# EAGLE design pcb (EAGLE 9.6.2)
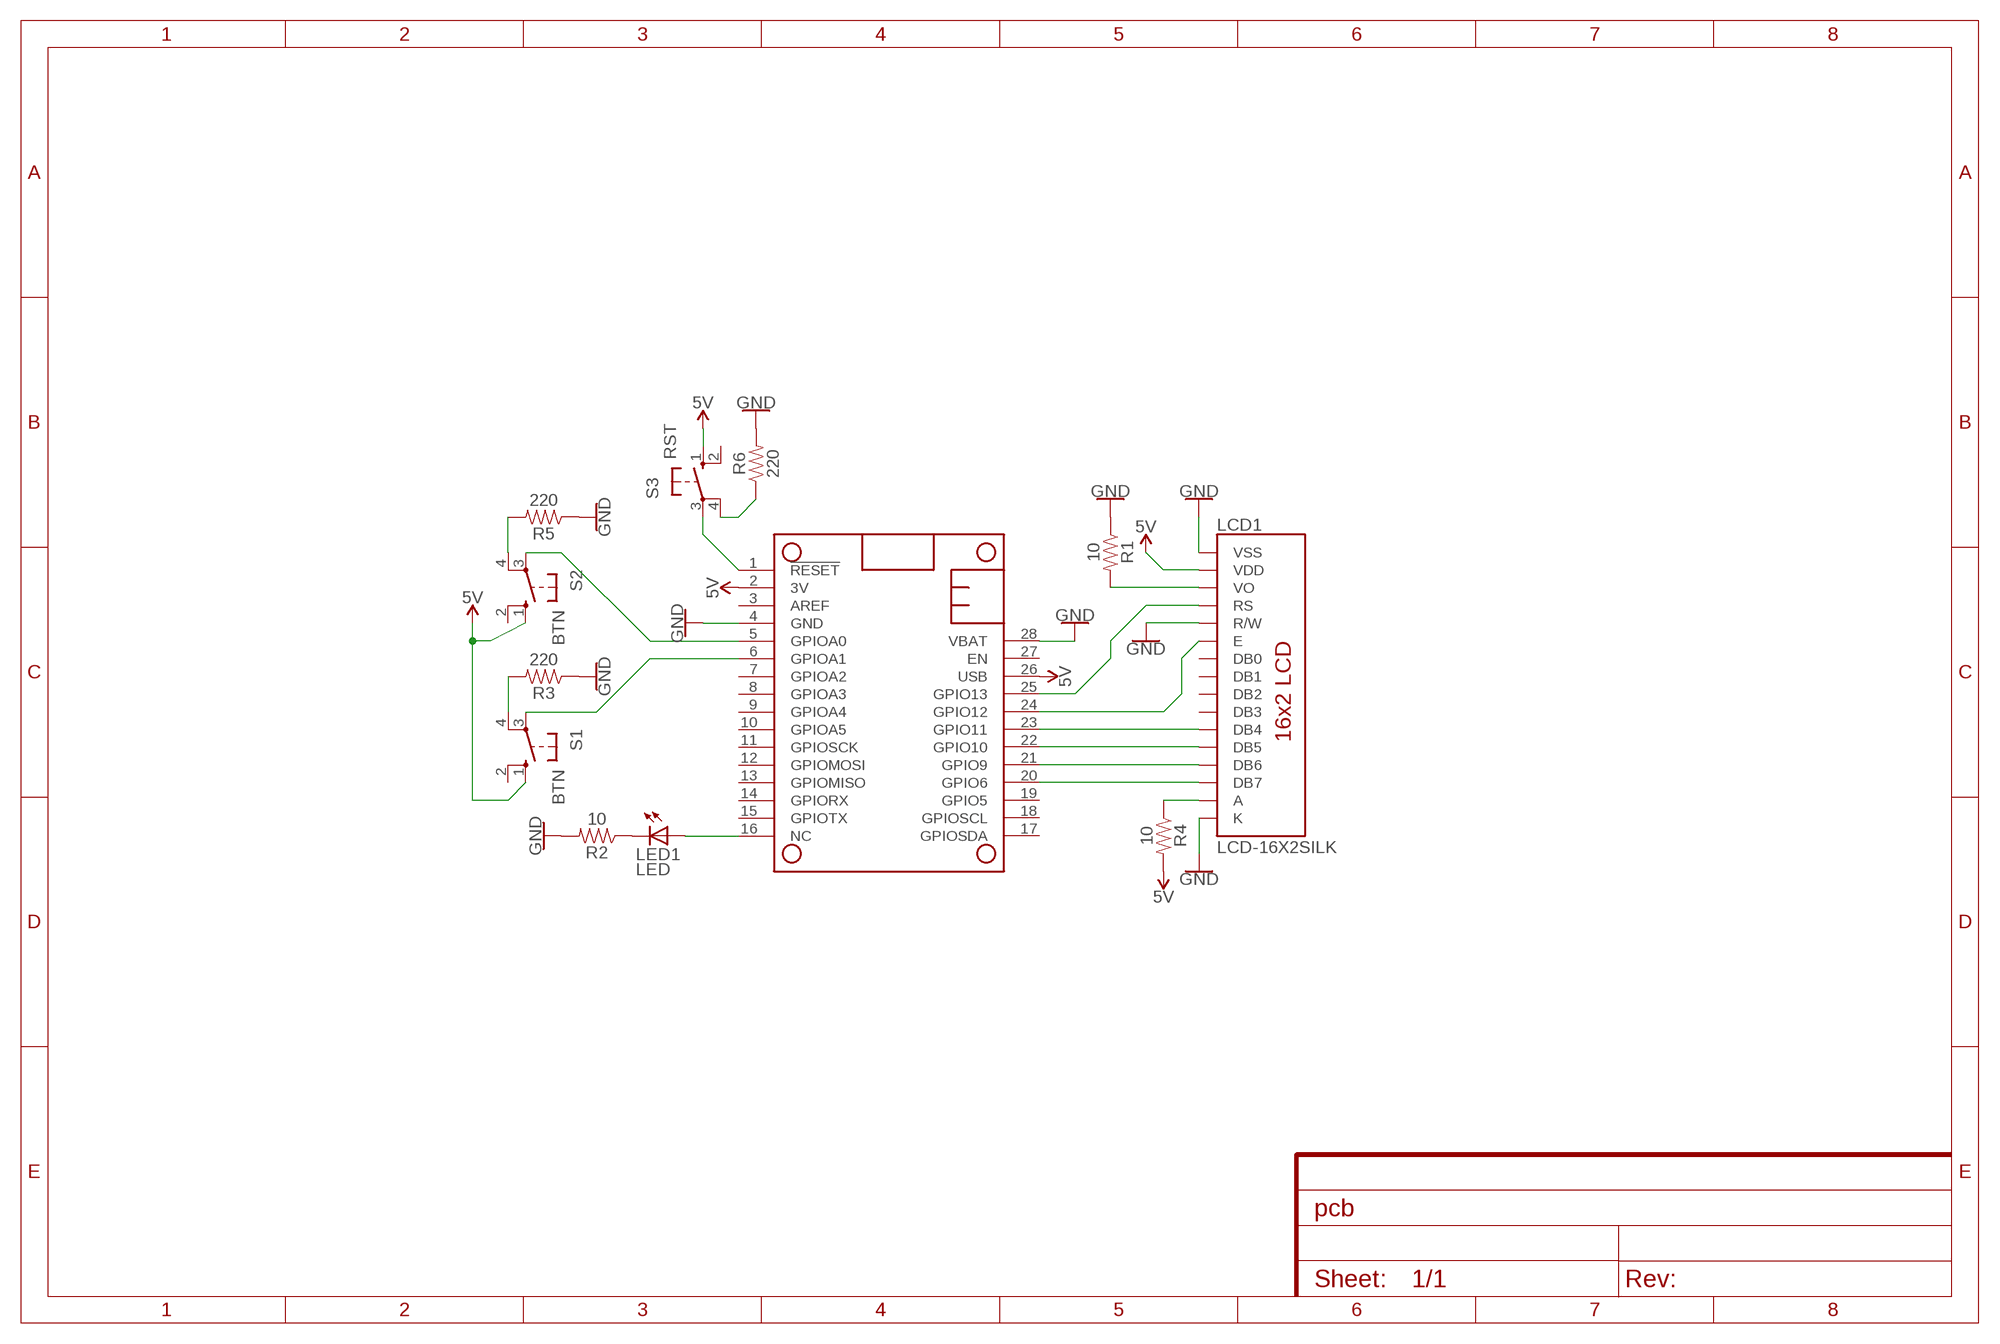
[diagram p0: schematic, sheet 1]

## Parts
LCD1  LCD-16X2SILK  [LCD-16X2]
LED1  LED  LED5MM  [LED5MM]
MS2  FEATHERWING  [FEATHERWING]
R1  10  10OHM-HORIZ-1/4W-1%  [AXIAL-0.3]
R2  10  10OHM-HORIZ-1/4W-1%  [AXIAL-0.3]
R3  220  220OHM-0603-1/10W-1%  [0603]
R4  10  10OHM-HORIZ-1/4W-1%  [AXIAL-0.3]
R5  220  220OHM-0603-1/10W-1%  [0603]
R6  220  220OHM-0603-1/10W-1%  [0603]
S1  BTN  40-XX-ROUND  [B3F-40XX-ROUND]
S2  BTN  40-XX-ROUND  [B3F-40XX-ROUND]
S3  RST  40-XX-ROUND  [B3F-40XX-ROUND]

## Nets
5V: LCD1.2(VDD) MS2.2(3V) MS2.26(USB) R4.P$2 S1.1(S) S2.1(S) S3.1(S)
GND: LCD1.1(VSS) LCD1.5(R/W) LCD1.16(K) MS2.4(GND) MS2.28(VBAT) R1.P$1 R2.P$2 R3.1 R5.1 R6.2
N$1: R3.2 S1.4(P1)
N$2: R5.2 S2.4(P1)
N$3: MS2.3(AREF) S1.2(S1)
N$4: LCD1.14(DB7) MS2.20(GPIO6)
N$5: LCD1.13(DB6) MS2.21(GPIO9)
N$6: LCD1.12(DB5) MS2.22(GPIO10)
N$7: LCD1.11(DB4) MS2.23(GPIO11)
N$8: MS2.6(GPIOA1) S1.3(P)
N$9: LED1.A MS2.16(NC)
N$10: LED1.K(C) R2.P$1
N$11: LCD1.15(A) R4.P$1
N$12: MS2.1(!RESET) S3.3(P)
N$13: LCD1.3(VO) R1.P$2
N$14: LCD1.4(RS) MS2.25(GPIO13)
N$15: R6.1 S3.4(P1)
N$16: MS2.5(GPIOA0) S2.3(P)
N$19: LCD1.6(E) MS2.24(GPIO12)
Unconnected: LCD1.7(DB0) LCD1.8(DB1) LCD1.9(DB2) LCD1.10(DB3) MS2.7(GPIOA2) MS2.8(GPIOA3) MS2.9(GPIOA4) MS2.10(GPIOA5) MS2.11(GPIOSCK) MS2.12(GPIOMOSI) MS2.13(GPIOMISO) MS2.14(GPIORX) MS2.15(GPIOTX) MS2.17(GPIOSDA) MS2.18(GPIOSCL) MS2.19(GPIO5) MS2.27(EN) S2.2(S1) S3.2(S1)

## Library data of the parts
LCD1 = SparkFun-Displays:LCD-16X2: Standard text-only 16x2 parallel input LCD Basic 16 character by 2 line display. Typically utilizes the extremely common HD44780 parallel interface chipset SparkFun Products: Basic 16x2 Green <https://www.sparkfun.com/products/255> Basic 8x2 Green <https://www.sparkfun.com/products/11122>; PROD_ID: LCD-12633; SF_ID: LCD-00255
LED1 = adafruit:LED: LED OSRAM: - CHIPLED LG R971, LG N971, LY N971, LG Q971, LY Q971, LO R971, LY R971 LH N974, LH R974 LS Q976, LO Q976, LY Q976 LO Q996 - Hyper CHIPLED LW Q18S LB Q993, LB Q99A, LB R99A - SideLED LS A670, LO A670, LY A670, LG A670, LP A670 LB A673, LV A673, LT A673, LW A673 LH A674 LY A675 LS A676, LA A676, LO A676, LY A676, LW A676 LS A679, LY A679, LG A679 - Hyper Micro SIDELED® LS Y876, LA Y876, LO Y876, LY Y876 LT Y87S - SmartLED LW L88C, LW L88S LB L89C, LB L89S, LG L890 LS L89K, LO L89K, LY L89K LS L896, LA L896, LO L896, LY L896 - TOPLED LS T670, LO T670, LY T670, LG T670, LP T670 LSG T670, LSP T670, LSY T670, LOP T670, LYG T670 LG T671, LOG T671, LSG T671 LB T673, LV T673, LT T673, LW T673 LH T674 LS T676, LA T676, LO T676, LY T676, LB T676, LH T676, LSB T676, LW T676 LB T67C, LV T67C, LT T67C, LS T67K, LO T67K, LY T67K, LW E67C LS E67B, LA E67B, LO E67B, LY E67B, LB E67C, LV E67C, LT E67C LW T67C LS T679, LY T679, LG T679 LS T770, LO T770, LY T770, LG T770, LP T770 LB T773, LV T773, LT T773, LW T773 LH T774 LS E675, LA E675, LY E675, LS T675 LS T776, LA T776, LO T776, LY T776, LB T776 LHGB T686 LT T68C, LB T68C - Hyper Mini TOPLED® LB M676 - Mini TOPLED Santana® LG M470 LS M47K, LO M47K, LY M47K Source: http://www.osram.convergy.de/
MS2 = adafruit:FEATHERWING
R1 R2 R4 = SparkFun-Resistors:10OHM: 10Ω resistor A resistor is a passive two-terminal electrical component that implements electrical resistance as a circuit element. Resistors act to reduce current flow, and, at the same time, act to lower voltage levels within circuits. - Wikipedia; PROD_ID: RES-12180
R3 R5 R6 = SparkFun-Resistors:220OHM: 220Ω resistor A resistor is a passive two-terminal electrical component that implements electrical resistance as a circuit element. Resistors act to reduce current flow, and, at the same time, act to lower voltage levels within circuits. - Wikipedia; PROD_ID: RES-07861
S1-S3 = adafruit:40-XX: OMRON SWITCH

## Board
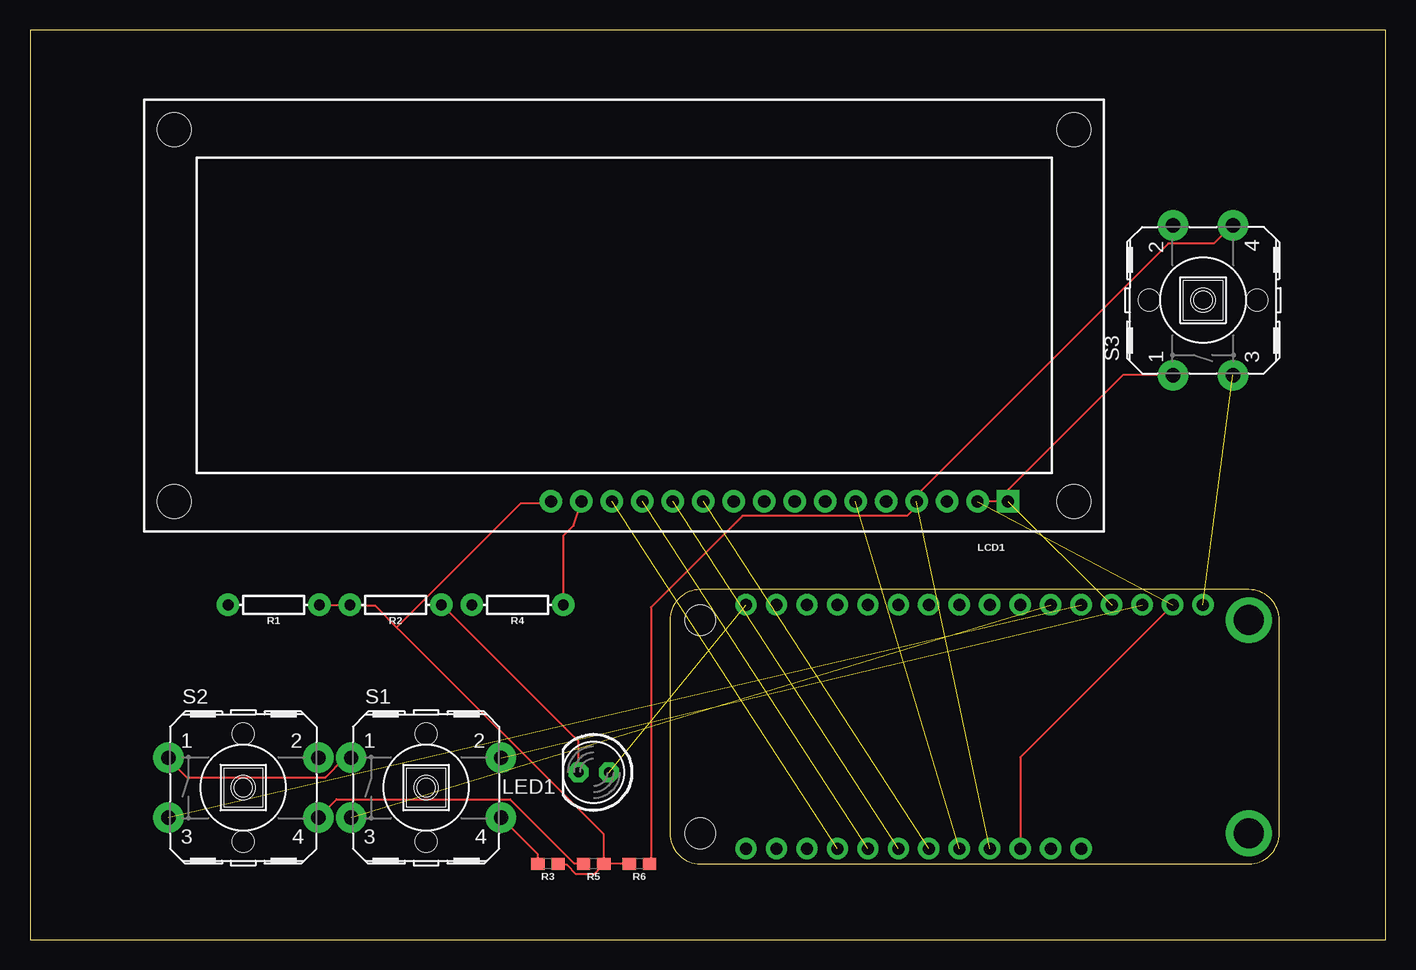
[diagram p1: board, top side]
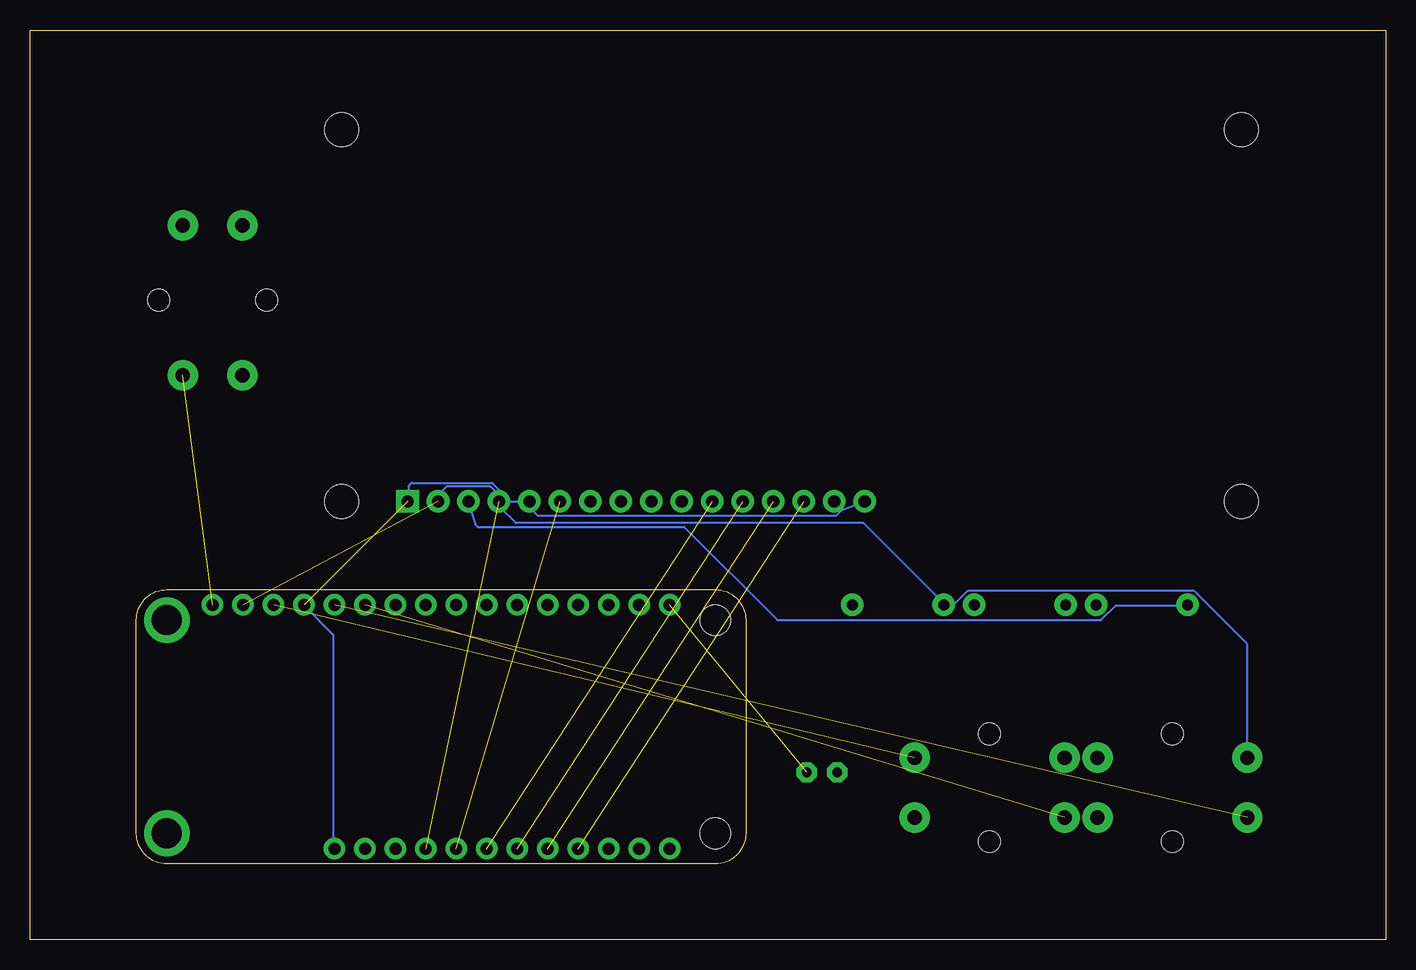
[diagram p2: board, bottom side, seen from below]

Size 113.01 x 75.87 mm. Coordinates in mm from the lower left corner, seen from the top.
Outline: 0,0 113.01,0 113.01,75.87 0,75.87 0,0
Copper layers (1*16): Top 0.035mm / dielectric 1.5mm / Bottom 0.035mm
Design rules "default": minimum track width 6mil, minimum drill 0.35mm, track to track 6mil, track to pad 6mil, pad to pad 6mil, via to via 6mil, smd to smd 6mil, copper to edge 40mil, drill to drill 6mil, minimum pad ring 10mil, minimum via ring 8mil, stop-mask expansion 4mil, vias tented up to drill 0mil, thermal gap 10mil

### Footprints (pad centres in the part's own frame; a part is rotated, then mirrored left to right if it is on the bottom)
LCD-16X2 = drill 1.016 pad 1.88 square: 1 -32,15.5 | drill 1.016 pad 1.88: 2 -29.46,15.5; 3 -26.92,15.5; 4 -24.38,15.5; 5 -21.84,15.5; 6 -19.3,15.5; 7 -16.76,15.5; 8 -14.22,15.5; 9 -11.68,15.5; 10 -9.14,15.5; 11 -6.6,15.5; 12 -4.06,15.5; 13 -1.52,15.5; 14 1.02,15.5; 15 3.56,15.5; 16 6.1,15.5 | hole 2.8: -37.5,15.5; -37.5,-15.5; 37.5,15.5; 37.5,-15.5
LED5MM = drill 0.813 pad 1.676 octagon: A -1.27,0; K 1.27,0
FEATHERWING = drill 1 pad 1.778: 1 6.35,1.27; 2 8.89,1.27; 3 11.43,1.27; 4 13.97,1.27; 5 16.51,1.27; 6 19.05,1.27; 7 21.59,1.27; 8 24.13,1.27; 9 26.67,1.27; 10 29.21,1.27; 11 31.75,1.27; 12 34.29,1.27; 13 36.83,1.27; 14 39.37,1.27; 15 41.91,1.27; 16 44.45,1.27; 17 44.45,21.59; 18 41.91,21.59; 19 39.37,21.59; 20 36.83,21.59; 21 34.29,21.59; 22 31.75,21.59; 23 29.21,21.59; 24 26.67,21.59; 25 24.13,21.59; 26 21.59,21.59; 27 19.05,21.59; 28 16.51,21.59 | drill 2.5 pad 3.81: P$1 2.54,20.32; P$2 2.54,2.54 | hole 2.54: 48.26,20.32; 48.26,2.54
AXIAL-0.3 = drill 0.9 pad 1.88: P$1 -3.81,0; P$2 3.81,0
0603 = smd 1.1 x 1: 1 -0.85,0; 2 0.85,0
B3F-40XX-ROUND = drill 1.194 pad 2.54: 1 -6.248,2.489; 2 6.248,2.489; 3 -6.248,-2.489; 4 6.248,-2.489 | hole 1.803: 0,-4.496; 0,4.496

### Placement (x,y rotation side)
LCD1  49.53,52.07 180 top
LED1  46.99,13.97 180 top
MS2  104.14,29.21 180 top
R1  20.32,27.94 180 top
R2  30.48,27.94 180 top
R3  43.18,6.35 180 top
R4  40.64,27.94 180 top
R5  46.99,6.35 180 top
R6  50.8,6.35 180 top
S1  33.02,12.7 0 top
S2  17.78,12.7 0 top
S3  97.79,53.34 90 top

### Tracks (layer width: path | path; a pad name or v marks a point on that pad's centre or on a via)
5V  (1 unrouted)
  Top 0.152: S3.1 91.08,47.09 80.57,36.58 LCD1.2 | S1.1 26.77,15.09 26.16,15.09 24.64,13.56 13.06,13.56 11.53,15.09 S2.1 | MS2.26 82.55,15.24 MS2.2
  Bottom 0.152: 36.83,28.04 35.92,28.04 34.85,29.11 15.95,29.11 11.53,24.69 S2.1 | 36.83,28.04 43.54,34.75 72.49,34.75 73.86,36.12 73.86,37.03 74.62,37.8 78.28,37.8 79.5,36.58 79.5,36.57 LCD1.2 | 36.83,28.04 R4.P$2
GND  (1 unrouted)
  Top 0.152: R3.1 44.15,6.25 44.76,6.25 45.52,5.49 47.04,5.49 47.8,6.25 R5.1 | R6.2 49.94,6.4 47.95,6.4 R5.1 | 30.58,26.06 28.75,27.89 26.77,27.89 R2.P$2 26.62,27.89 24.18,27.89 R1.P$1 | 30.58,26.06 47.8,8.84 47.8,6.4 R5.1 | 30.58,26.06 40.95,36.42 43.33,36.42 LCD1.16
  Bottom 0.152: MS2.28 87.73,7.62 87.73,25.45 90.17,27.89 MS2.4 | LCD1.1 81.45,37.83 81.18,38.1 74.47,38.1 72.95,36.58 LCD1.5 71.37,36.07 70.66,35.36 45.82,35.36 45.31,35.87 LCD1.16
N$1
  Top 0.152: S1.4 42.32,7.16 42.32,6.4 R3.2
N$2
  Top 0.152: S2.4 25.55,11.73 40.03,11.73 45.36,6.4 46.13,6.4 R5.2
N$3  (1 unrouted)
N$4  (1 unrouted)
N$5  (1 unrouted)
N$6  (1 unrouted)
N$7  (1 unrouted)
N$8  (1 unrouted)
N$9  (1 unrouted)
N$10
  Top 0.152: LED1.K 45.67,14.02 45.67,16.61 34.39,27.89 R2.P$1
N$11
  Top 0.152: R4.P$1 44.45,33.68 45.33,34.56 LCD1.15
N$12  (1 unrouted)
N$13
  Bottom 0.152: R1.P$2 16.56,27.89 22.5,27.89 23.72,26.67 50.7,26.67 58.47,34.44 75.69,34.44 75.81,34.56 LCD1.3
N$14  (1 unrouted)
N$15
  Top 0.152: R6.1 51.77,6.4 51.77,27.74 59.38,35.36 73.1,35.36 73.86,36.12 73.86,37.03 94.89,58.06 98.7,58.06 100.23,59.59 S3.4
N$16  (1 unrouted)
N$19  (1 unrouted)